# Altium schematic sheet Gate Driver.SchDoc
size A
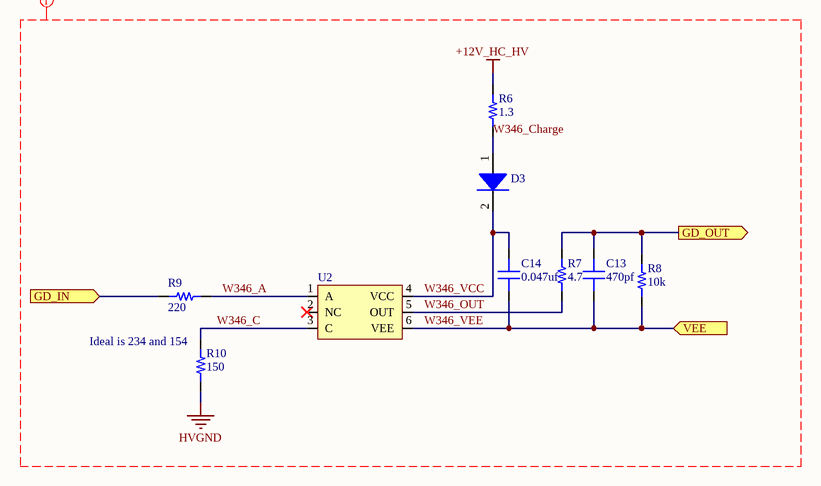
[diagram p0: Gate Driver.SchDoc]

## Parts
C13  value 470pf  [CAP 0603/1608]  (hidden comment: Capacitor MLCC 470pf 50V CAP 0603/1608)
C14  value 0.047uf  [CAP 1210/3225 - 1.6MM]  (hidden comment: Capacitor MLCC 50.047uf 630V CAP 1210/3225)
D3  (no value)  [SMA]
R6  value 1.3  [RES 1206/3216]  (hidden comment: RES 1.3 OHM 1% 1/4W 1206)
R7  value 4.7  [RES 0805/2012]  (hidden comment: Resistor 4.7 0805 1/4W 1%)
R8  value 10k  [RES 0603/1608]  (hidden comment: Resistor 10k 0603 1/10W 1%)
R9  value 220  [RES 0603/1608]  (hidden comment: Resistor 220 0603 1/10W 5%)
R10  value 150  [RES 0603/1608]  (hidden comment: Resistor 150 0603 1/10W 5%)
U2  (no value)  [SOIC-6 (8-mm Clearance)]

## Ports
GD_IN (in), GD_OUT (out), VEE (in)

## Nets
+12V_HC_HV: R6.2
HVGND: R10.1
GD_IN: R9.1 ; port GD_IN
GD_OUT: C13.2 R7.2 R8.2 ; port GD_OUT
W346_A: R9.2 U2.1(A)
W346_C: R10.2 U2.3(C)
W346_Charge: D3.1(A) R6.1
W346_OUT: R7.1 U2.5(OUT)
W346_VCC: C14.2 D3.2(K) U2.4(VCC)
W346_VEE: C13.1 C14.1 R8.1 U2.6(VEE) ; port VEE

Not connected (* = marked no-connect by the designer): U2 2(NC)*

## Layout directives
net class HV: +12V_HC_HV, HVGND, W346_A, W346_C, W346_Charge, W346_OUT, W346_VCC, W346_VEE

## Notes on the sheet
- (near R10) Ideal is 234 and 154

## Library data of the parts
C13 = 905: Manufacturer_id: 1; idCapacitor: 905; Name: Cap_470pf_50V_CAP 0603/1608; Dielectric: Ceramic; Created_By: Nick Mah; Drawer_id: 1; Voltage_Rating: 50V; Package: CAP 0603/1608; Created_Date: 10/20/2018
C14 = 1091: Manufacturer_id: 1; idCapacitor: 1091; Name: Cap_0.047uf_630V_CAP 1210/3225; Dielectric: Ceramic; Created_By: Nick Mah; Drawer_id: 1; Voltage_Rating: 630V; Package: CAP 1210/3225; ComponentLink1Description: Datasheet
D3 = 17: Diode Standard 1000V 1A Surface Mount SMA; mfrpartno: RS1MTR; Manufacturer_id: 1; idDiode: 17; Power: 1000Vr; Created_By: Nick; Drawer_id: 1; Name: RS1MTR; Value: 1A; Type: Standard; Num_Circuits: 1; Ic: 1A; Package: SMA; Link: https://www.digikey.com/product-detail/en/smc-diode-solutions/RS1MTR/1655-1501-1-ND/6022946; ComponentLink1Description: Datasheet; ComponentLink1URL: http://www.smc-diodes.com/propdf/RS1A-RS1M%20N0988%20REV.B.pdf; Supplier1: Digi-Key; Supplier1PartNo: 1655-1501-1-ND
R6 = 2714: 1.3 Ohms ±1% 0.25W, 1/4W Chip Resistor 1206 (3216 Metric)  Thick Film; Manufacturer_id: 1; MfrPartNo: MCR18ERTFL1R30; idResistor: 2714; Name: Res_1.3_1206_1/4W_1%; Created_By: Nick Mah; Supplier 1: Digi-Key; Supplier Part Number 1: RHM1.30CJCT-ND; Drawer_id: 1; Tolerance: 1%; Power: 1/4W; Package: 1206; Link: https://www.digikey.com/product-detail/en/rohm-semiconductor/MCR18ERTFL1R30/RHM1.30CJCT-ND/2796563; ComponentLink1Description: Datasheet; ComponentLink1URL: https://media.digikey.com/pdf/Compliance/Rohm/MCR18ERT_Material.pdf
R7 = 665: Manufacturer_id: 1; idResistor: 665; Name: Res_4.7_0805_1/4W_1%; Created_By: Nick Mah; Supplier 1: Digi-Key; Drawer_id: 1; Tolerance: 1%; Power: 1/4W; Package: 0805; ComponentLink1Description: Datasheet; Created_Date: 2018-10-20
R8 = 313: Manufacturer_id: 1; idResistor: 313; Name: Res_10k_0603_1/10W_1%; Created_By: Nick Mah; Supplier 1: Digi-Key; Drawer_id: 1; Tolerance: 1%; Power: 1/10W; Package: 0603; ComponentLink1Description: Datasheet; Created_Date: 2018-10-20
R9 = 1353: Manufacturer_id: 1; idResistor: 1353; Name: Res_220_0603_1/10W_5%; Created_By: Nick Mah; Supplier 1: Digi-Key; Drawer_id: 1; Tolerance: 5%; Power: 1/10W; Package: 0603; ComponentLink1Description: Datasheet; Created_Date: 2018-10-20
R10 = 1349: Manufacturer_id: 1; idResistor: 1349; Name: Res_150_0603_1/10W_5%; Created_By: Nick Mah; Supplier 1: Digi-Key; Drawer_id: 1; Tolerance: 5%; Power: 1/10W; Package: 0603; ComponentLink1Description: Datasheet; Created_Date: 2018-10-20
U2 = 5: OPTOISO 5KV 1CH GATE DRIVER 6SO; Manufacturer_id: 1; idPMIC_SW: 5; Power: 2.5A; Topology: Bootstrapped Gate Drive; Vin(Min): 10V; Vin(Max): 20V; Vout(Min): 0; Vout(Max): 20; Created_By: Nick; mfrpartno: ACPL-W346; Drawer_id: 1; Name: ACPL-W346; Value: Gate Driver; Output_Config: 1; Num_Outputs: 1; Current_Rating: 2.5A; Package: SOIC-6 Stretched; Link: https://www.digikey.com/product-detail/en/broadcom-limited/ACPL-W346-500E/516-3743-1-ND/6823064; ComponentLink1Description: Datasheet; ComponentLink1URL: https://docs.broadcom.com/docs/AV02-4078EN; Supplier1: Digi-Key; Supplier1PartNo: 516-3743-1-ND